# Altium schematic sheet Connectors.SchDoc: Connectors
size A4; DrawnBy: Flávio Silva; Engineer: Flávio Silva; Organization: CeNTI; Address1: Rua Fernando Mesquita 2785; Address2: Vila Nova de Famalicão; Address3: 4760-034, Portugal; Revision: 0; SheetNumber: 2; SheetTotal: 4; Project: AM2R- Safe2Wheels
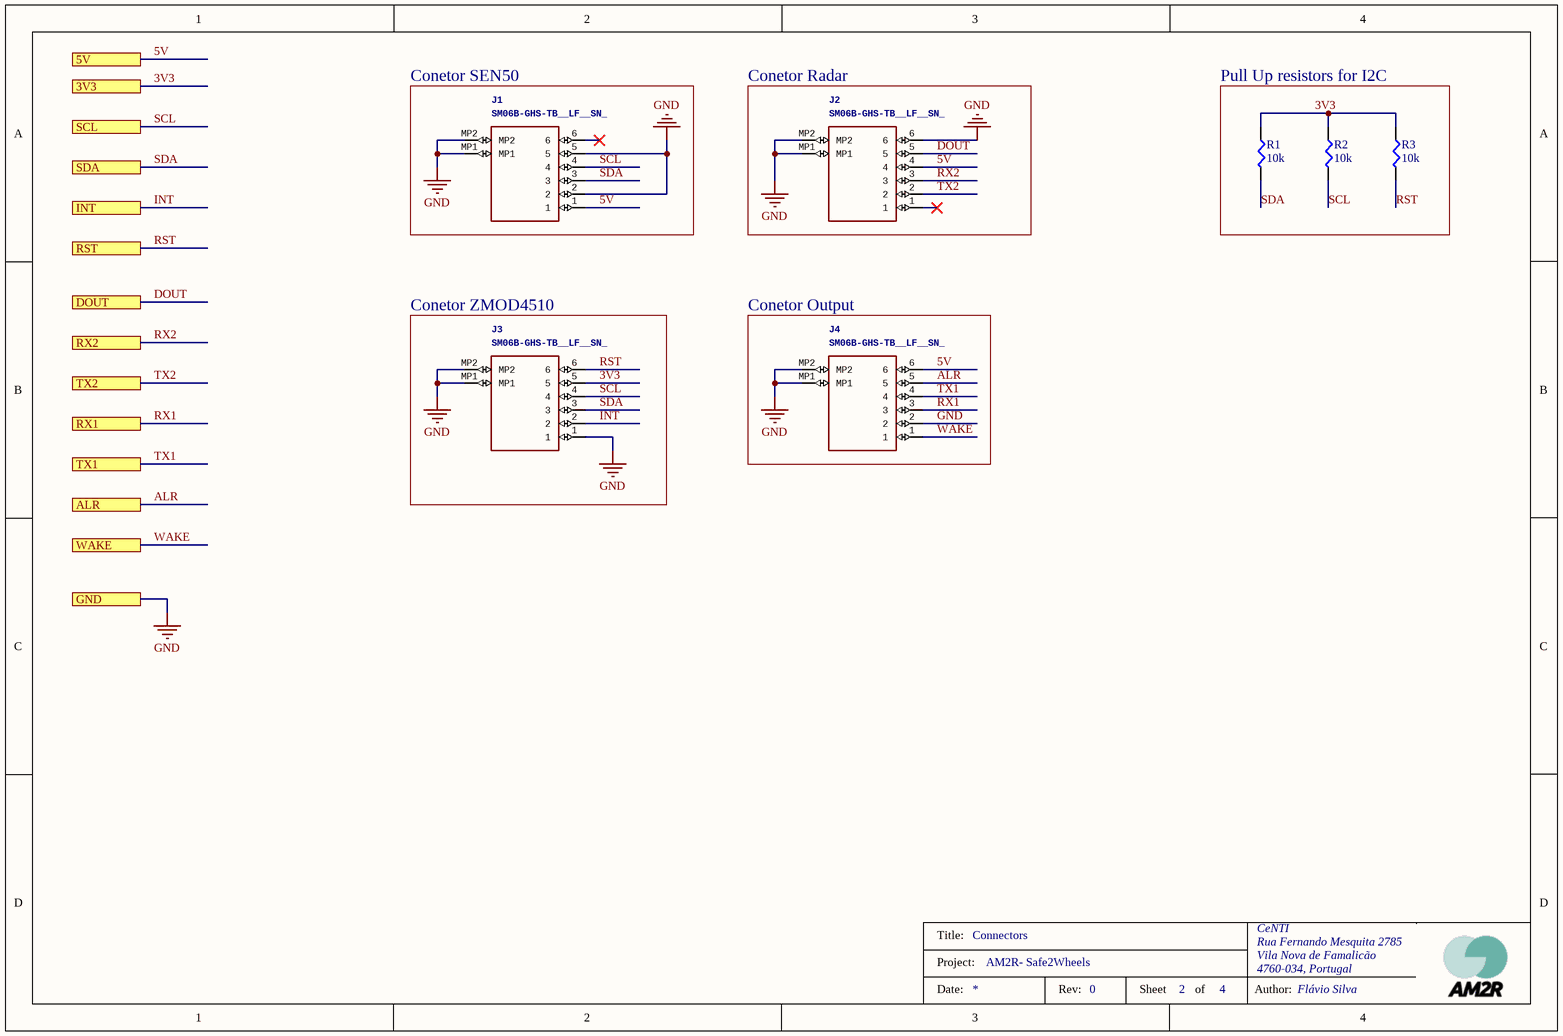
[diagram p0: Connectors.SchDoc]

## Parts
J1  SM06B-GHS-TB__LF__SN_  [SM06BGHSTBLFSN]
J2  SM06B-GHS-TB__LF__SN_  [SM06BGHSTBLFSN]
J3  SM06B-GHS-TB__LF__SN_  [SM06BGHSTBLFSN]
J4  SM06B-GHS-TB__LF__SN_  [SM06BGHSTBLFSN]
R1  10k  [SMD-0402-RES]
R2  10k  [SMD-0402-RES]
R3  10k  [SMD-0402-RES]

## Blocks framed on the sheet
Conetor SEN50: J1
Conetor Radar: J2
Pull Up resistors for I2C: R1-R3
Conetor ZMOD4510: J3
Conetor Output: J4

## Ports
3V3, 5V, ALR, DOUT, GND, INT, RST, RX1, RX2, SCL, SDA, TX1, TX2, WAKE

## Nets
GND: J1.2 J1.5 J1.MP1 J1.MP2 J2.6 J2.MP1 J2.MP2 J3.1 J3.MP1 J3.MP2 J4.2 J4.MP1 J4.MP2 ; port GND
3V3: J3.5 R1.1 R2.1 R3.1 ; port 3V3
5V: J1.1 J2.4 J4.6 ; port 5V
ALR: J4.5 ; port ALR
DOUT: J2.5 ; port DOUT
INT: J3.2 ; port INT
RST: J3.6 R3.2 ; port RST
RX1: J4.3 ; port RX1
RX2: J2.3 ; port RX2
SCL: J1.4 J3.4 R2.2 ; port SCL
SDA: J1.3 J3.3 R1.2 ; port SDA
TX1: J4.4 ; port TX1
TX2: J2.2 ; port TX2
WAKE: J4.1 ; port WAKE

Not connected (* = marked no-connect by the designer): J1 6*; J2 1*

## Notes on the sheet
- Title:
- Project:
- Date:
- Rev:
- Sheet
- of
- Author:

## Library data of the parts
J1-J4 = SM06B-GHS-TB__LF__SN_: Conn Shrouded Header HDR 6 POS 1.25mm Solder RA Side Entry SMD T/R   Source:  Datasheet; Manufacturer_Name: JST (JAPAN SOLDERLESS TERMINALS); Manufacturer_Part_Number: SM06B-GHS-TB (LF)(SN); GateName_1: G$1; SymbolName_1: SM06B-GHS-TB__LF__SN_; LibraryName: SM06B-GHS-TB__LF__SN_; DeviceSetName: SM06B-GHS-TB__LF__SN_; Arrow_Part_Number: SM06B-GHS-TB (LF)(SN); Arrow_Price-Stock: https://www.arrow.com/en/products/sm06b-ghs-tb-lf-sn/jst-manufacturing; Height: 4.25mm
R1-R3 = ERJ-2GEJ103X: RES SMD 10K OHM 5% 1/10W 0402; Manufacturer: Panasonic Electronic Components; Factory Stock: 0; Unit Price (USD): 0.00350; @ qty: 1500; Minimum Quantity: 1; Power (Watts): 0.1W, 1/10W; Temperature Coefficient: ±200ppm/°C; Part Number: ERJ-2GEJ103X; Datasheets: http://industrial.panasonic.com/www-cgi/jvcr13pz.cgi?E+PZ+3+AOA0001+ERJ2GEJ103X+7+WW; Image: //media.digikey.com/Photos/Panasonic%20Photos/ERJ-PA2-Series.jpg; Digi-Key Part Number: P10KJCT-ND; Quantity Available: 2560215; Packaging: Cut Tape (CT); Series: ERJ; Part Status: Active; Value: 10k; Tolerance: ±5%; Composition: Thick Film; Features: Automotive AEC-Q200; Operating Temperature: -55°C ~ 155°C; Package / Case: 0402 (1005 Metric); Supplier Device Package: 0402; Size / Dimension: 0.039" L x 0.020" W (1.00mm x 0.50mm); Height - Seated (Max): 0.016" (0.40mm); Number of Terminations: 2; Failure Rate: -